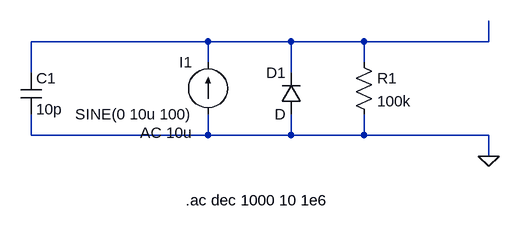
[diagram p0: schematic Draft1.asc]
Draft1.asc, the LTspice schematic file:
Version 4
SHEET 1 880 680
WIRE 144 80 -128 80
WIRE 272 80 144 80
WIRE 384 80 272 80
WIRE 576 80 576 48
WIRE 576 80 384 80
WIRE 144 112 144 80
WIRE 384 112 384 80
WIRE -128 128 -128 80
WIRE 272 128 272 80
WIRE -128 224 -128 192
WIRE 144 224 144 192
WIRE 144 224 -128 224
WIRE 272 224 272 192
WIRE 272 224 144 224
WIRE 384 224 384 192
WIRE 384 224 272 224
WIRE 576 224 384 224
WIRE 576 256 576 224
FLAG 576 256 0
SYMBOL diode 288 192 R180
WINDOW 0 24 64 Left 2
WINDOW 3 24 0 Left 2
SYMATTR InstName D1
SYMBOL res 368 96 R0
SYMATTR InstName R1
SYMATTR Value 100k
SYMBOL cap -144 128 R0
SYMATTR InstName C1
SYMATTR Value 10p
SYMBOL current 144 192 R180
WINDOW 0 24 80 Left 2
WINDOW 3 24 0 Left 2
WINDOW 123 24 -28 Left 2
WINDOW 39 0 0 Left 0
SYMATTR InstName I1
SYMATTR Value SINE(0 10u 100)
SYMATTR Value2 AC 10u
TEXT 110 324 Left 2 !.ac dec 1000 10 1e6

The netlist it stands for:
* Draft1.asc
D1 0 N001 D
R1 N001 0 100k
C1 N001 0 10p
I1 0 N001 SINE(0 10u 100) AC 10u
.model D D
.lib standard.dio
.ac dec 1000 10 1e6
.backanno
.end